# EAGLE schematic RS485_converter (EAGLE 7.2.0)
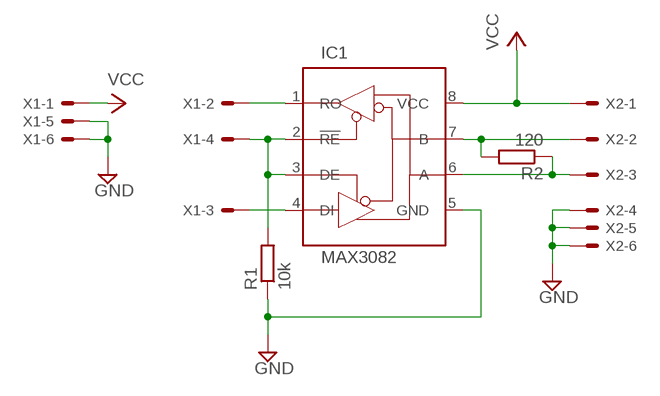
[diagram p0: schematic, sheet 1]

## Parts
IC1  MAX3082  MAX3082CPD  [DIL08]
R1  10k  R-EU_0207/12  [0207/12]
R2  120  R-EU_0207/12  [0207/12]
X1  332-06  [332-06]
X2  332-06  [332-06]

## Nets
GND: IC1.5(GND) R1.1 X1.5 X1.6 X2.4 X2.5 X2.6
N$1: IC1.1(RO) X1.2
N$2: IC1.2(!RE!) IC1.3(DE) R1.2 X1.4
N$3: IC1.4(DI) X1.3
N$4: IC1.7(B) R2.2 X2.2
N$5: IC1.6(A) R2.1 X2.3
VCC: IC1.8(VCC) X1.1 X2.1

## Library data of the parts
IC1 = myLibrary:MAX3082: RS485 transceiver Converting from logical RS232 to differential RS485, and vice versa.; OC_FARNELL: unknown; OC_NEWARK: unknown
R1 R2 = resistor:R-EU_: RESISTOR, European symbol
X1 X2 = con-garry:332-06: 6 Pin - 2mm Dual Row Source: www.mpe-connector.de / garry_shortform_2012.pdf